# Altium schematic sheet [16] - CAN BUS.SchDoc: CAN Tranceiver
size A4; DrawnBy: Dale Matthews; Revision: V1I1; SheetNumber: 1; SheetTotal: 1
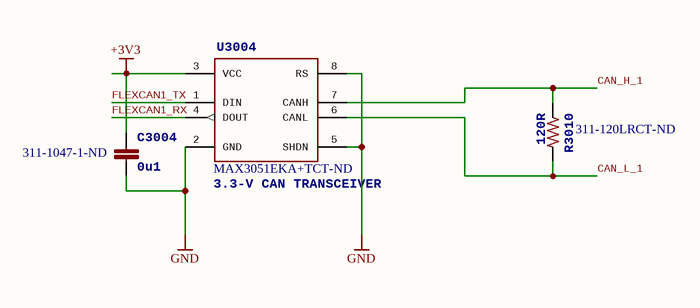
[diagram p0: [16] - CAN BUS.SchDoc]

## Parts
C3004  0u1  Supplier Part Number 1: 311-1047-1-ND  [0402-CAP]
R3010  120R  Supplier Part Number 1: 311-120LRCT-ND  [0402-RES]
U3004  3.3-V CAN TRANSCEIVER  Supplier Part Number 1: MAX3051EKA+TCT-ND  [SOT23-8]

## Nets
+3V3: C3004.P$1 U3004.3(VCC)
GND: C3004.P$2 U3004.2(GND) U3004.5(SHDN) U3004.8(RS)
CAN_H_1: R3010.P$1 U3004.7(CANH)
CAN_L_1: R3010.P$2 U3004.6(CANL)
FLEXCAN1_RX: U3004.4(DOUT)
FLEXCAN1_TX: U3004.1(DIN)

## Library data of the parts
C3004 = CAP0402: CAP CER 0.1UF 16V Y5V 0402; PARTNO: CC0402ZRY5V7BB104; 3DR_PARTNO: ECM0700; Supplier 1: Digi-Key; Value: 0u1
R3010 = RESISTOR0402-RES: RES 120 OHM 1/16W 1% 0402 SMD; PARTNO: RC0402FR-07120RL; 3DR_PARTNO: ECM0820; Supplier 1: Digi-Key; Value: 120R
U3004 = MAX3051MAX3051EKA: IC TXRX CAN 1MBPS SOT23-8; 3DR_PARTNO: ECM0831; PARTNO: MAX3051EKA+T; Supplier 1: Digi-Key; Value: CAN